# Altium project 接收器.PrjPcb
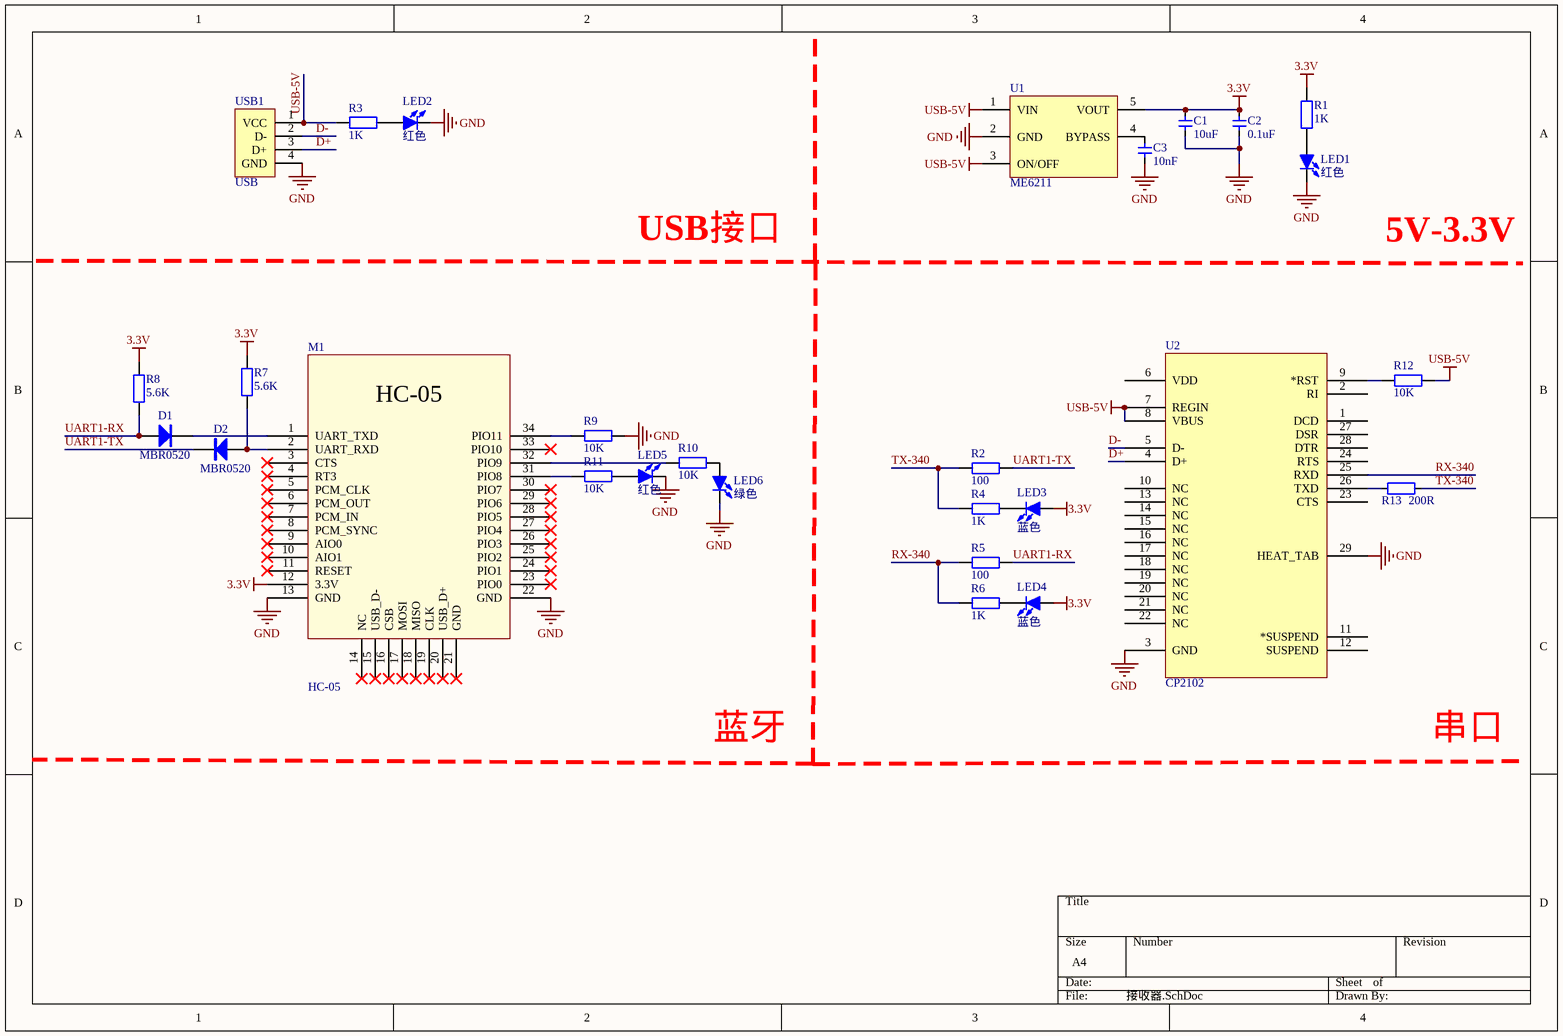
[diagram p0: 接收器.SchDoc]
1 sheet, 28 parts. Net scope: global (net labels, ports and power ports of the same name join across sheets).
Board file: 接收器.PcbDoc

## Sheet 接收器.SchDoc
size A4

### Parts
C1  10uF  [C 0402_L]
C2  0.1uF  [C 0402_L]
C3  10nF  [C 0402_L]
D1  MBR0520  [SOD-123]
D2  MBR0520  [SOD-123]
LED1  红色  [LED 0603R]
LED2  红色  [LED 0603R]
LED3  蓝色  [LED 0603B]
LED4  蓝色  [LED 0603B]
LED5  红色  [LED 0603R]
LED6  绿色  [LED 0603G]
M1  HC-05  [HC-05]
R1  1K  [R 0402_L]
R2  100  [R 0402_L]
R3  1K  [R 0402_L]
R4  1K  [R 0402_L]
R5  100  [R 0402_L]
R6  1K  [R 0402_L]
R7  5.6K  [R 0402_L]
R8  5.6K  [R 0402_L]
R9  10K  [R 0402_L]
R10  10K  [R 0402_L]
R11  10K  [R 0402_L]
R12  10K  [R 0402_L]
R13  200R  [R 0402_L]
U1  ME6211  [SOT23-5]
U2  CP2102  [QFN-28]
USB1  USB  [USB_A/P_A]

### Nets
3.3V: C1.2 C2.2 LED3.1(A) LED4.1(A) M1.12(3.3V) R1.2 R7.2 R8.2 U1.5(VOUT)
GND: C1.1 C2.1 C3.1 LED1.2(K) LED2.2(K) LED5.2(K) LED6.2(K) M1.13(GND) M1.22(GND) R9.2 U1.2(GND) U2.3(GND) U2.29(HEAT_TAB) USB1.4(GND)
USB-5V: R3.2 R12.1 U1.1(VIN) U1.3(ON/OFF) U2.7(REGIN) U2.8(VBUS) USB1.1(VCC)
D+: U2.4(D+) USB1.3(D+)
D-: U2.5(D-) USB1.2(D-)
RX-340: R5.1 R6.1 U2.25(RXD)
TX-340: R2.1 R4.1 R13.1
UART1-RX: D1.1(A) R5.2 R8.1
UART1-TX: D2.2(K) R2.2
NetC3_2: C3.2 U1.4(BYPASS)
NetD1_2: D1.2(K) M1.1(UART_TXD)
NetD2_1: D2.1(A) M1.2(UART_RXD) R7.1
NetLED1_1: LED1.1(A) R1.1
NetLED2_1: LED2.1(A) R3.1
NetLED3_2: LED3.2(K) R4.2
NetLED4_2: LED4.2(K) R6.2
NetLED5_1: LED5.1(A) R11.2
NetLED6_1: LED6.1(A) R10.2
NetM1_31: M1.31(PIO8) R11.1
NetM1_32: M1.32(PIO9) R10.1
NetM1_34: M1.34(PIO11) R9.1
NetR12_2: R12.2 U2.9(*RST)
NetR13_2: R13.2 U2.26(TXD)

Not connected (* = marked no-connect by the designer): M1 3(CTS)* 4(RT3)* 5(PCM_CLK)* 6(PCM_OUT)* 7(PCM_IN)* 8(PCM_SYNC)* 9(AIO0)* 10(AIO1)* 11(RESET)* 14(NC)* 15(USB_D-)* 16(CSB)* 17(MOSI)* 18(MISO)* 19(CLK)* 20(USB_D+)* 21(GND)* 23(PIO0)* 24(PIO1)* 25(PIO2)* 26(PIO3)* 27(PIO4)* 28(PIO5)* 29(PIO6)* 30(PIO7)* 33(PIO10)*; U2 1(DCD) 2(RI) 6(VDD) 10(NC) 11(*SUSPEND) 12(SUSPEND) 13(NC) 14(NC) 15(NC) 16(NC) 17(NC) 18(NC) 19(NC) 20(NC) 21(NC) 22(NC) 23(CTS) 24(RTS) 27(DSR) 28(DTR)

### Notes on the sheet
- USB接口
- 5V-3.3V
- 蓝牙
- 串口

### Library data of the parts
C1-C3 = 电容-0402: Capacitor; Value: 0.1u
D1 D2 = 1N4007: 整流二极管; 淘宝ID: 封装库来自淘宝 ID：黄晶宝石; 封装库来自淘宝卖家 ID：黄晶宝石: 其他店铺购入均为盗版，不享受售后技术支持服务，请立即申请退款; BOM名称: 整流二极管; 联系售后，技术支持: https://shop463601444.taobao.com
LED1-LED6 = LED-SMD: 贴片LED; 版权归属: 封装库来自淘宝 ID：黄晶宝石; BOM名称: 贴片LED; 学习资源: https://shop463601444.taobao.com
M1 = HC-05: 串口蓝牙模块; 版权归属: 源创客; BOM名称: 串口蓝牙模块; 学习资源: www.ooocke.com
R1-R12 = R: 贴片电阻; 版权归属: 来自淘宝 ID：黄晶宝石; 封装库来自淘宝卖家 ID：黄晶宝石: 其他店铺购入均为盗版，不享受售后技术支持服务，请立即申请退款; BOM名称: 贴片电阻; 联系售后: https://shop463601444.taobao.com
R13 = 电阻-0402: Resistor; Value: 22R
U1 = ME6211: DC降压芯片
U2 = CP2102: USB转TTL; PART DESC: SINGLE-CHIP USB TO UART BRIDGE, QFN28, RoHS.; MFG #1: SILICON LABS; PART NUMBER: CP2102; Value: Value; RefDes: RefDes; Type: DEV
USB1 = USB-A/P: USB-A型公接口; 版权归属: 源创客; BOM名称: USB-A型公接口; 学习资源: www.ooocke.com